# EAGLE design transformerless power Supply 5v (EAGLE 9.6.2)
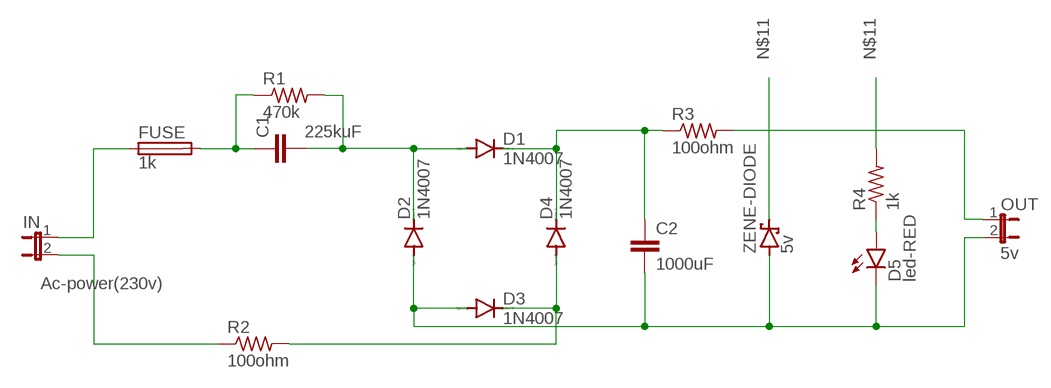
[diagram p0: schematic, sheet 1]

## Parts
C1  225kuF  C5/3  [C5B3]
C2  1000uF  C5/3  [C5B3]
D1  1N4007  1N4004  [DO41-10]
D2  1N4007  1N4004  [DO41-10]
D3  1N4007  1N4004  [DO41-10]
D4  1N4007  1N4004  [DO41-10]
D5  led-RED  SFH482  [SFH482]
FUSE  1k  FUSEPICOFUSE  [PICOFUSE]
IN  Ac-power(230v)  JP1E  [JP1]
OUT  5v  JP1E  [JP1]
R1  470k  R-US_0207/10  [0207/10]
R2  100ohm  R-US_0207/10  [0207/10]
R3  100ohm  R-US_0207/10  [0207/10]
R4  1k  R-US_0207/10  [0207/10]
ZENE-DIODE  5v  P6KEXXA  [C1702-15]

## Nets
N$1: FUSE.1 IN.1
N$2: C1.1 FUSE.2 R1.1
N$3: D5.A R4.1
N$4: IN.2 R2.1
N$5: D3.C D4.A R2.2
N$6: C1.2 D1.A D2.C R1.2
N$7: C2.1 D1.C D4.C R3.1
N$8: OUT.1 R3.2
N$9: C2.2 D2.A D3.A D5.K(C) OUT.2 ZENE-DIODE.A
N$11: R4.2 ZENE-DIODE.C

## Library data of the parts
C1 C2 = capacitor-wima:C: CAPACITOR naming: grid - package width
D1-D4 = diode:1N4004: DIODE general purpose rectifier, 1 A
D5 = led:SFH482: IR LED infrared emitting diode, Infineon
FUSE = fuse:FUSE: Fuse; OC_FARNELL: unknown; OC_NEWARK: unknown
IN OUT = jumper:JP1E: JUMPER
R1-R4 = rcl:R-US_: RESISTOR, American symbol; SPICEPREFIX: R
ZENE-DIODE = diode:P6KEXXA: DIODE transient-voltage suppressor

## Board
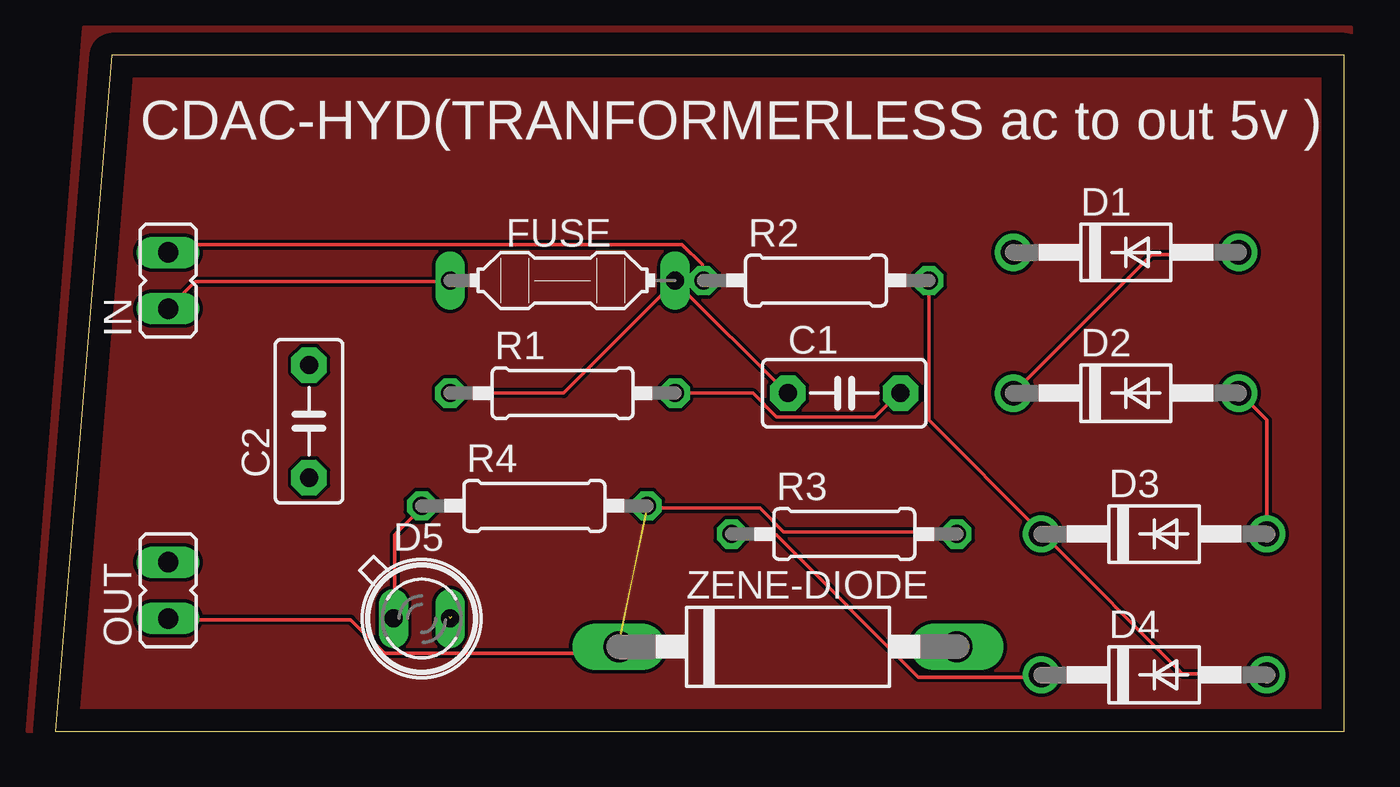
[diagram p1: board, top side]
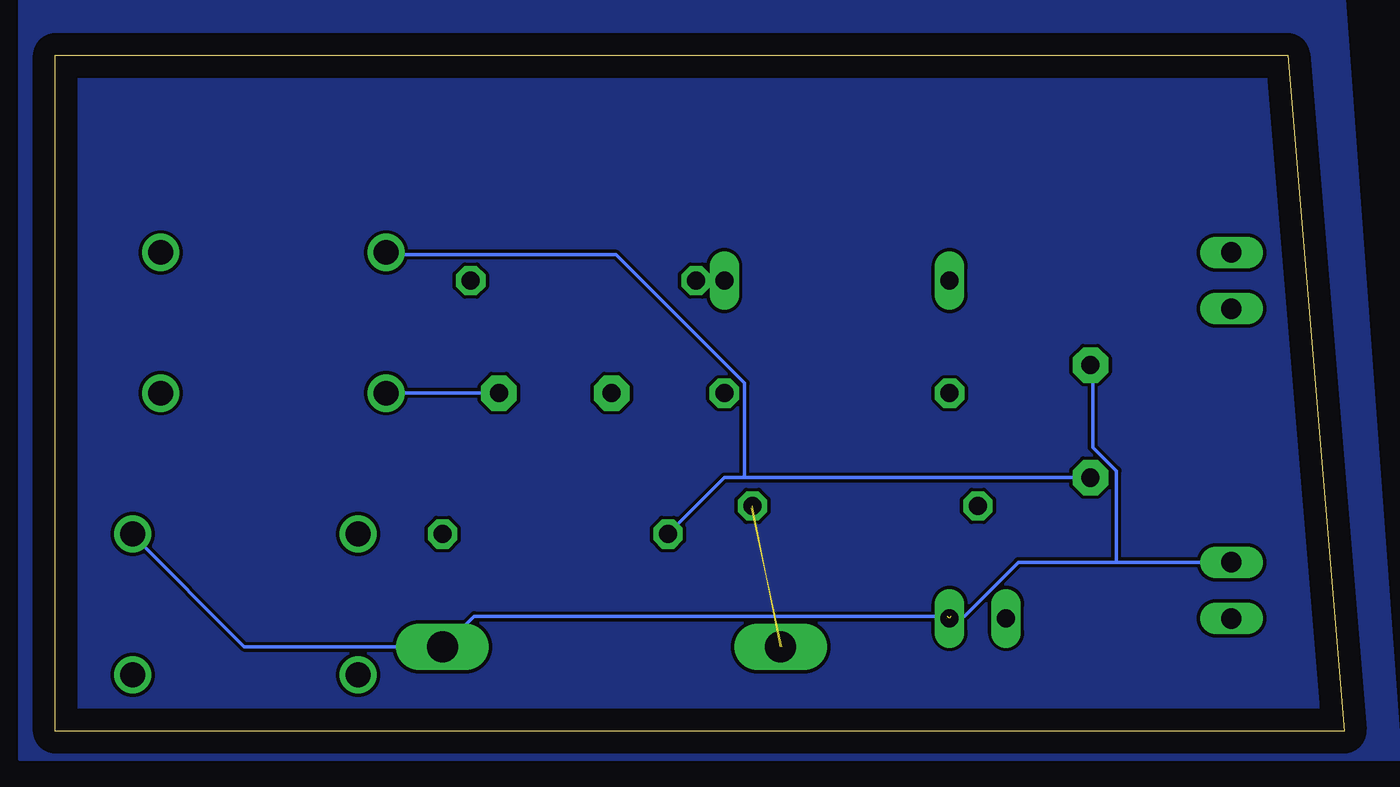
[diagram p2: board, bottom side, seen from below]

Size 58.09 x 30.47 mm. Coordinates in mm from the lower left corner, seen from the top.
Outline: 0,0 58.09,0 58.09,30.47 2.54,30.47 0,0
Copper layers (1*16): Top 0.035mm / dielectric 1.5mm / Bottom 0.035mm
Design rules "default": minimum track width 6mil, minimum drill 0.35mm, track to track 6mil, track to pad 6mil, pad to pad 6mil, via to via 6mil, smd to smd 6mil, copper to edge 40mil, drill to drill 6mil, minimum pad ring 10mil, minimum via ring 8mil, stop-mask expansion 4mil, vias tented up to drill 0mil, thermal gap 10mil

### Footprints (pad centres in the part's own frame; a part is rotated, then mirrored left to right if it is on the bottom)
C5B3 = drill 0.813 pad 1.6 octagon: 1 -2.54,0; 2 2.54,0
DO41-10 = drill 1.118: A 5.08,0; C -5.08,0
SFH482 = drill 0.813 long: A -1.27,0; K 1.27,0
PICOFUSE = drill 0.813 long: 1 -5.08,0; 2 5.08,0
JP1 = drill 0.914 long: 1 0,-1.27; 2 0,1.27
0207/10 = drill 0.813 octagon: 1 -5.08,0; 2 5.08,0
C1702-15 = drill 1.397 long: A 7.62,0; C -7.62,0

### Placement (x,y rotation side)
C1  35.56,15.24 0 top
C2  11.43,13.97 90 top
D1  48.26,21.59 0 top
D2  48.26,15.24 0 top
D3  49.53,8.89 0 top
D4  49.53,2.54 0 top
D5  16.51,5.08 0 top
FUSE  22.86,20.32 0 top
IN  5.08,20.32 0 top
OUT  5.08,6.35 0 top
R1  22.86,15.24 0 top
R2  34.29,20.32 0 top
R3  35.56,8.89 0 top
R4  21.59,10.16 0 top
ZENE-DIODE  33.02,3.81 0 top

### Tracks (layer width: path | path; a pad name or v marks a point on that pad's centre or on a via)
N$1
  Top 0.152: IN.1 6.3,20.27 17.73,20.27 FUSE.1
N$2
  Top 0.152: R1.1 22.91,15.24 27.94,20.27 | 27.94,20.27 32.97,15.24 C1.1 | 27.94,20.27 FUSE.2
N$3
  Top 0.152: D5.A 15.29,5.18 15.29,8.84 16.51,10.06 R4.1
N$4
  Top 0.152: R2.1 29.16,20.42 29.16,21.03 28.25,21.95 5.38,21.95 5.08,21.64 IN.2
N$5
  Top 0.152: R2.2 39.37,14.02 44.4,8.99 D3.C 44.55,8.84 50.8,2.59 54.61,2.59 D4.A
N$6
  Top 0.152: R1.2 31.45,15.24 32.51,14.17 36.93,14.17 38,15.24 C1.2 | D2.C 49.43,21.49 53.24,21.49 D1.A
  Bottom 0.152: C1.2 D2.C
N$7
  Top 0.152: R3.1 30.53,8.84 32.51,8.84 38.91,2.44 44.4,2.44 D4.C
  Bottom 0.152: 27.03,11.43 27.94,11.43 R3.1 | 27.03,11.43 C2.1 | 27.03,11.43 27.03,15.7 32.82,21.49 43.18,21.49 D1.C
N$8  (1 unrouted)
  Top 0.152: 26.72,10.06 31.75,10.06 32.82,8.99 40.59,8.99 R3.2 | 25.35,3.81 25.04,3.5 14.83,3.5 13.31,5.03 5.08,5.03 OUT.1
N$9  (2 unrouted)
  Top 0.152: D3.A 54.61,14.02 53.39,15.24 D2.A
  Bottom 0.152: 17.73,5.18 17.12,5.18 14.68,7.62 10.26,7.62 | OUT.2 10.26,7.62 | 10.26,7.62 10.26,11.73 11.33,12.8 11.33,16.46 C2.2 | D3.A 54.61,8.84 49.58,3.81 ZENE-DIODE.A 40.59,3.81 39.22,5.18 17.88,5.18
N$11  (1 unrouted)
OUT
  pour Bottom: 0,33.02 59.69,33.02 59.69,-1.27 -2.54,-1.27
TOP
  pour Top: 1.27,31.75 58.42,31.75 58.42,0 -1.27,0

### Text on the board
tPlace: CDAC-HYD(TRANFORMERLESS ac to out 5v )